# EAGLE design gyro (EAGLE 5.10)
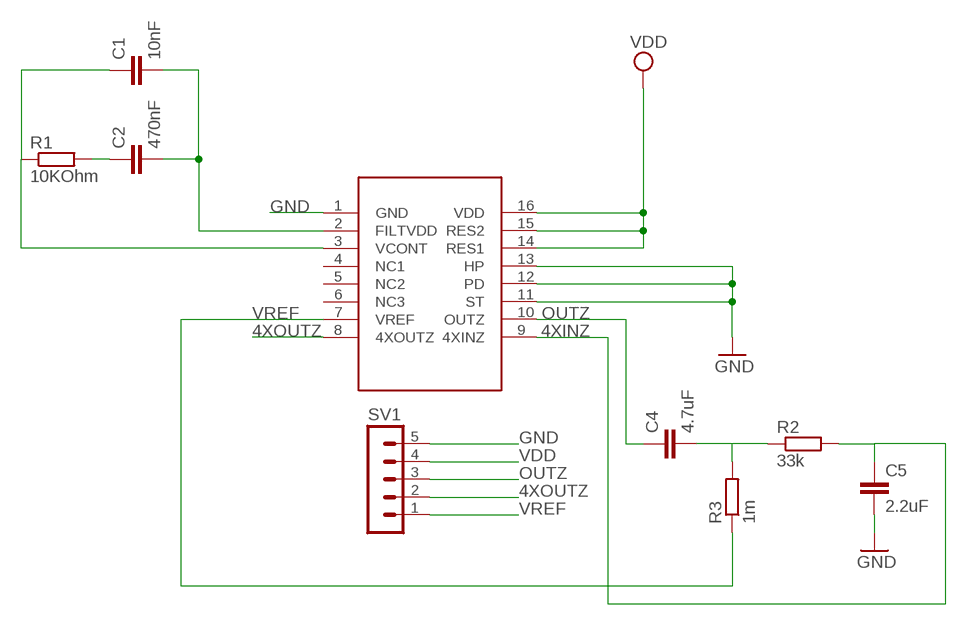
[diagram p0: schematic, sheet 1]

## Parts
C1  10nF  C-EUC0805  [C0805]
C2  470nF  C-EUC0805  [C0805]
C4  4.7uF  C-EUC1206  [C1206]
C5  2.2uF  C-EUC1206  [C1206]
R1  10KOhm  R-EU_R0805  [R0805]
R2  33k  R-EU_M0805  [M0805]
R3  1m  R-EU_M0805  [M0805]
SV1  MA05-1  [MA05-1]
U$1  LY530ALH  [LGA16-5X5]

## Nets
4XINZ: C5.1 R2.2 U$1.9(4XINZ)
4XOUTZ: SV1.2 U$1.8(4XOUTZ)
GND: C5.2 SV1.5 U$1.1(GND) U$1.11(ST) U$1.12(PD) U$1.13(HP)
N$1: C2.1 R1.2
N$3: C1.2 C2.2 U$1.2(FILTVDD)
N$4: C1.1 R1.1 U$1.3(VCONT)
N$6: C4.2 R2.1 R3.2
OUTZ: C4.1 SV1.3 U$1.10(OUTZ)
VDD: SV1.4 U$1.14(RES1) U$1.15(RES2) U$1.16(VDD)
VREF: R3.1 SV1.1 U$1.7(VREF)
Unconnected: U$1.4(NC1) U$1.5(NC2) U$1.6(NC3)

## Library data of the parts
C1 C2 C4 C5 = rcl:C-EU: CAPACITOR, European symbol
R1 = resistor:R-EU_: RESISTOR, European symbol
R2 R3 = rcl:R-EU_: RESISTOR, European symbol
SV1 = con-lstb:MA05-1: PIN HEADER
U$1 = LY530ALH:LY530ALH

## Board
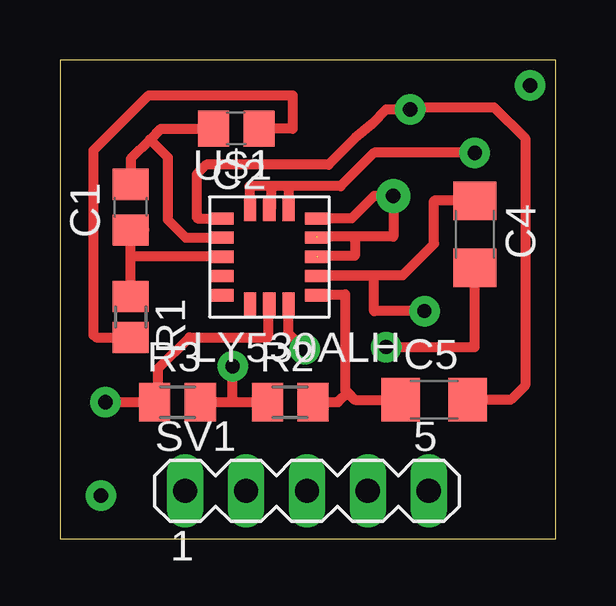
[diagram p1: board, top side]
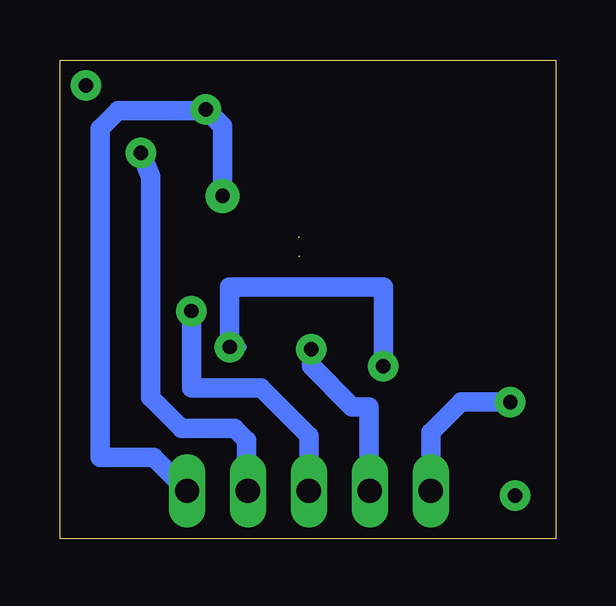
[diagram p2: board, bottom side, seen from below]

Size 20.68 x 19.97 mm. Coordinates in mm from the lower left corner, seen from the top.
Outline: 0,0 20.68,0 20.68,19.97 0,19.97 0,0
Copper layers (1*16): Top 0.035mm / dielectric 1.5mm / Bottom 0.035mm
Design rules "default": minimum track width 10mil, minimum drill 24mil, track to track 8mil, track to pad 8mil, pad to pad 8mil, via to via 8mil, smd to smd 8mil, copper to edge 40mil, drill to drill 8mil, minimum pad ring 10mil, minimum via ring 8mil, stop-mask expansion 4mil, vias tented up to drill 0mil, thermal gap 10mil

### Footprints (pad centres in the part's own frame; a part is rotated, then mirrored left to right if it is on the bottom)
C0805 = smd 1.3 x 1.5: 1 -0.95,0; 2 0.95,0
C1206 = smd 1.6 x 1.8: 1 -1.4,0; 2 1.4,0
R0805 = smd 1.3 x 1.5: 1 -0.85,0; 2 0.85,0
M0805 = smd 1.3 x 1.6: 1 -0.95,0; 2 0.95,0
MA05-1 = drill 1.016 long: 1 -5.08,0; 2 -2.54,0; 3 0,0; 4 2.54,0; 5 5.08,0
LGA16-5X5 = smd 1.016 x 0.508: 1 -2,1.6; 2 -2,0.8; 3 -2,0; 4 -2,-0.8; 5 -2,-1.6; 9 2,-1.6; 10 2,-0.8; 11 2,0; 12 2,0.8; 13 2,1.6 | smd 0.508 x 1.016: 6 -0.8,-2; 7 0,-2; 8 0.8,-2; 14 0.8,2; 15 0,2; 16 -0.8,2

### Placement (x,y rotation side)
C1  2.95,13.83 90 top
C2  7.35,17.11 180 top
C4  17.3,12.7 270 top
C5  15.6,5.8 0 top
R1  2.95,9.25 270 top
R2  9.6,5.7 0 top
R3  4.9,5.7 0 top
SV1  10.3,2 0 top
U$1  8.73,11.76 0 top

### Tracks (layer width: path | path; a pad name or v marks a point on that pad's centre or on a via)
4XINZ
  Top 0.406: U$1.9 11.86,10.16 11.9,10.2 11.9,6.2 12,6.1 | 12,6.1 12.3,5.8 C5.1 | R2.2 11.6,5.7 12,6.1
4XOUTZ  (via drill 0.6 pad 1.27)
  Top 0.406: U$1.8 9.53,8.57 v10.2,7.9
  Bottom 0.813: v10.2,7.9 10.2,7.2 8.5,5.5 7.8,5.5 7.8,2.04 SV1.2
GND  (via drill 0.6 pad 1.27, 0.6 pad 1.42)  (2 unrouted)
  Top 0.406: U$1.1 5.74,13.36 5.7,13.4 5.7,15.2 6.1,15.6 11.2,15.6 12.3,16.7 13,17.3 13.6,17.9 v14.6,17.9 14.7,18 18.1,18 19.4,16.7 19.4,6.4 18.8,5.8 C5.2 | U$1.13 12.16,13.36 13.1,14.3 v13.9,14.3 13.9,12.6 12.3,12.6 | 12.3,12.6 10.7,12.6 | 10.7,11.8 12.3,11.8 12.3,12.6
  Bottom 0.813: v13.9,14.3 13.9,17.2 v14.6,17.9 14.65,17.85 18.25,17.85 19,17.1 19,3.4 16.78,3.4 SV1.5
N$1
  Top 0.406: R1.2 1.5,8.4 1.4,8.5 1.4,16.2 3.7,18.5 9.7,18.5 9.7,17.1 9.69,17.11 C2.1
N$3
  Top 0.406: C1.2 2.95,15.85 3.75,16.65 | 3.75,16.65 4.2,17.1 C2.2 | U$1.2 5.24,12.56 4.5,13.3 4.5,15.9 3.75,16.65
N$4
  Top 0.406: R1.1 2.95,11.8 | 2.95,11.8 C1.1 3.52,12.88 | U$1.3 6.69,11.8 2.95,11.8
N$5  (via drill 0.6 pad 1.27)
  other vias: 7.2,7.2
N$6  (via drill 0.6 pad 1.27)
  Top 0.406: C4.2 17.3,8 v13.6,8 | R3.2 7.2,5.7 | 7.2,5.7 R2.1 | 7.2,5.7 v7.2,7.2
  Bottom 0.406: v13.6,8 13.1,8
  Bottom 0.813: v7.2,7.2 7.2,10.5 13.6,10.5 v13.6,8
N$7  (via drill 0.6 pad 1.27)
  other vias: 1.7,1.8
N$8  (via drill 0.6 pad 1.27)
  other vias: 19.6,18.9
OUTZ  (via drill 0.6 pad 1.27)
  Top 0.406: C4.1 15.6,14.1 15.6,12.3 14.3,11 10.77,11 U$1.10 13.1,10.96 13.1,9.5 v15.2,9.5
  Bottom 0.813: v15.2,9.5 15.2,6.3 12.3,6.3 10.3,4.3 SV1.3
VDD  (via drill 0.6 pad 1.27)
  Top 0.406: 17.6,16.1 v17.3,16.1 13.1,16.1 11.7,14.7 9.53,14.7 | 9.53,14.7 U$1.14 | U$1.15 8.8,13.76 8.8,14.7 | 9.53,14.7 8.8,14.7 | U$1.16 7.9,13.76 7.9,14.7 8.8,14.7
  Bottom 0.813: v17.3,16.1 16.9,15.1 16.9,5.9 15.6,4.6 13.4,4.6 12.9,4.1 12.9,2.06 SV1.4
VREF  (via drill 0.6 pad 1.27)
  Top 0.406: U$1.7 8.7,9.76 8.7,8.4 5.4,8.4 4.1,7.1 4.1,5.85 R3.1 v1.9,5.7
  Bottom 0.813: SV1.1 5.22,4.43 R3.1 v1.9,5.7